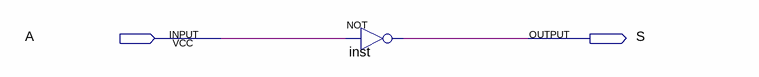
[diagram p0: schematic sheet]
// Quartus schematic Complemento1.bdf as structural Verilog: 1 symbols, 2 pins
module Complemento1 (
  input  A,
  output S
);

  not inst (S, A);
endmodule
